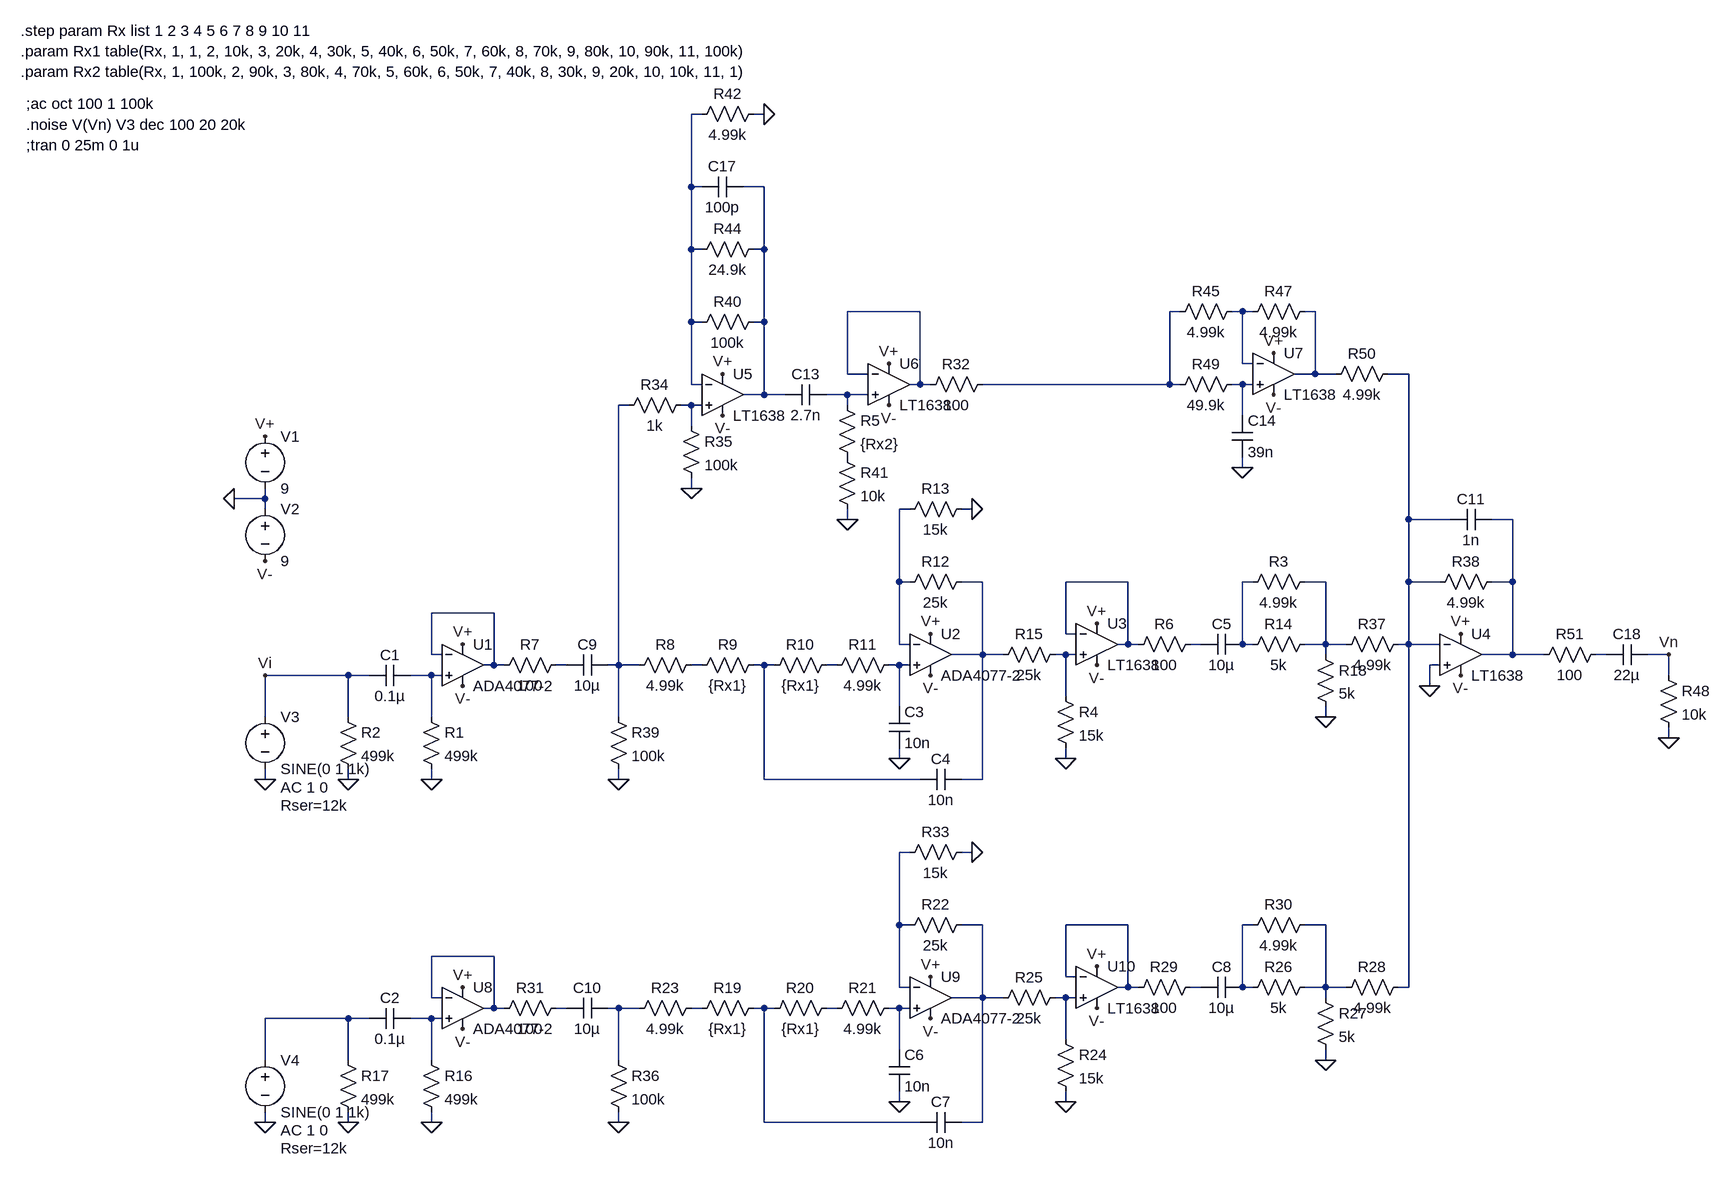
[diagram p0: schematic CB_FILTER.asc]
CB_FILTER.asc, the LTspice schematic file:
Version 4
SHEET 1 3604 4264
WIRE 592 -608 576 -608
WIRE 688 -608 672 -608
WIRE 576 -496 576 -608
WIRE 592 -496 576 -496
WIRE 688 -496 656 -496
WIRE 576 -400 576 -496
WIRE 592 -400 576 -400
WIRE 688 -400 688 -496
WIRE 688 -400 672 -400
WIRE 928 -304 816 -304
WIRE 1328 -304 1312 -304
WIRE 1424 -304 1408 -304
WIRE 1440 -304 1424 -304
WIRE 1536 -304 1520 -304
WIRE 576 -288 576 -400
WIRE 592 -288 576 -288
WIRE 688 -288 688 -400
WIRE 688 -288 672 -288
WIRE 1424 -224 1424 -304
WIRE 1440 -224 1424 -224
WIRE 816 -208 816 -304
WIRE 848 -208 816 -208
WIRE 1536 -208 1536 -304
WIRE 1536 -208 1504 -208
WIRE 1568 -208 1536 -208
WIRE 1680 -208 1648 -208
WIRE 576 -192 576 -288
WIRE 592 -192 576 -192
WIRE 928 -192 928 -304
WIRE 928 -192 912 -192
WIRE 944 -192 928 -192
WIRE 1312 -192 1312 -304
WIRE 1312 -192 1024 -192
WIRE 1328 -192 1312 -192
WIRE 1424 -192 1408 -192
WIRE 1440 -192 1424 -192
WIRE 688 -176 688 -288
WIRE 688 -176 656 -176
WIRE 720 -176 688 -176
WIRE 816 -176 784 -176
WIRE 848 -176 816 -176
WIRE 480 -160 464 -160
WIRE 576 -160 560 -160
WIRE 592 -160 576 -160
WIRE 816 -160 816 -176
WIRE 1424 -144 1424 -192
WIRE 576 -128 576 -160
WIRE 1424 -64 1424 -80
WIRE 576 -32 576 -48
WIRE -80 -16 -80 -32
WIRE -80 -16 -128 -16
WIRE -80 0 -80 -16
WIRE 912 0 896 0
WIRE 1008 0 992 0
WIRE 816 16 816 0
WIRE 1680 16 1680 -208
WIRE 1744 16 1680 16
WIRE 1840 16 1808 16
WIRE 896 112 896 0
WIRE 912 112 896 112
WIRE 1024 112 992 112
WIRE 1248 112 1152 112
WIRE 1440 112 1424 112
WIRE 1552 112 1520 112
WIRE 1680 112 1680 16
WIRE 1728 112 1680 112
WIRE 1840 112 1840 16
WIRE 1840 112 1808 112
WIRE 272 160 176 160
WIRE 1152 192 1152 112
WIRE 1168 192 1152 192
WIRE 896 208 896 112
WIRE 912 208 896 208
WIRE 1248 208 1248 112
WIRE 1248 208 1232 208
WIRE 1264 208 1248 208
WIRE 1360 208 1344 208
WIRE 1424 208 1424 112
WIRE 1440 208 1424 208
WIRE 1552 208 1552 112
WIRE 1552 208 1520 208
WIRE 1584 208 1552 208
WIRE 1680 208 1680 112
WIRE 1680 208 1664 208
WIRE 1728 208 1680 208
WIRE 176 224 176 160
WIRE 192 224 176 224
WIRE 1024 224 1024 112
WIRE 1024 224 976 224
WIRE 1056 224 1024 224
WIRE 1152 224 1136 224
WIRE 1168 224 1152 224
WIRE 1552 224 1552 208
WIRE 1840 224 1840 112
WIRE 1840 224 1792 224
WIRE 1888 224 1840 224
WIRE 1984 224 1968 224
WIRE 2080 224 2048 224
WIRE 272 240 272 160
WIRE 272 240 256 240
WIRE 288 240 272 240
WIRE 384 240 368 240
WIRE 464 240 464 -160
WIRE 464 240 448 240
WIRE 496 240 464 240
WIRE 592 240 576 240
WIRE 688 240 672 240
WIRE 704 240 688 240
WIRE 800 240 784 240
WIRE 896 240 880 240
WIRE 912 240 896 240
WIRE 1728 240 1712 240
WIRE 48 256 -80 256
WIRE 80 256 48 256
WIRE 176 256 144 256
WIRE 192 256 176 256
WIRE 2080 256 2080 224
WIRE 1712 272 1712 240
WIRE 1152 288 1152 224
WIRE 896 304 896 240
WIRE -80 320 -80 256
WIRE 48 320 48 256
WIRE 176 320 176 256
WIRE 464 320 464 240
WIRE 1552 320 1552 304
WIRE 2080 352 2080 336
WIRE 896 384 896 368
WIRE 1152 384 1152 368
WIRE -80 416 -80 400
WIRE 48 416 48 400
WIRE 176 416 176 400
WIRE 464 416 464 400
WIRE 688 416 688 240
WIRE 928 416 688 416
WIRE 1024 416 1024 224
WIRE 1024 416 992 416
WIRE 912 528 896 528
WIRE 1008 528 992 528
WIRE 896 640 896 528
WIRE 912 640 896 640
WIRE 1024 640 992 640
WIRE 1248 640 1152 640
WIRE 1440 640 1424 640
WIRE 1552 640 1520 640
WIRE 272 688 176 688
WIRE 1152 720 1152 640
WIRE 1168 720 1152 720
WIRE 896 736 896 640
WIRE 912 736 896 736
WIRE 1248 736 1248 640
WIRE 1248 736 1232 736
WIRE 1264 736 1248 736
WIRE 1360 736 1344 736
WIRE 1424 736 1424 640
WIRE 1440 736 1424 736
WIRE 1552 736 1552 640
WIRE 1552 736 1520 736
WIRE 1584 736 1552 736
WIRE 1680 736 1680 208
WIRE 1680 736 1664 736
WIRE 176 752 176 688
WIRE 192 752 176 752
WIRE 1024 752 1024 640
WIRE 1024 752 976 752
WIRE 1056 752 1024 752
WIRE 1152 752 1136 752
WIRE 1168 752 1152 752
WIRE 1552 752 1552 736
WIRE 272 768 272 688
WIRE 272 768 256 768
WIRE 288 768 272 768
WIRE 384 768 368 768
WIRE 464 768 448 768
WIRE 496 768 464 768
WIRE 592 768 576 768
WIRE 688 768 672 768
WIRE 704 768 688 768
WIRE 800 768 784 768
WIRE 896 768 880 768
WIRE 912 768 896 768
WIRE 48 784 -80 784
WIRE 80 784 48 784
WIRE 176 784 144 784
WIRE 192 784 176 784
WIRE 1152 816 1152 752
WIRE 896 832 896 768
WIRE -80 848 -80 784
WIRE 48 848 48 784
WIRE 176 848 176 784
WIRE 464 848 464 768
WIRE 1552 848 1552 832
WIRE 896 912 896 896
WIRE 1152 912 1152 896
WIRE -80 944 -80 928
WIRE 48 944 48 928
WIRE 176 944 176 928
WIRE 464 944 464 928
WIRE 688 944 688 768
WIRE 928 944 688 944
WIRE 1024 944 1024 752
WIRE 1024 944 992 944
FLAG -128 -16 0
FLAG -80 -112 V+
FLAG -80 80 V-
FLAG 48 416 0
FLAG -80 416 0
FLAG 1200 240 V-
FLAG 1200 176 V+
FLAG 944 256 V-
FLAG 944 192 V+
FLAG 1008 0 0
FLAG 896 384 0
FLAG 2080 224 Vn
FLAG 1152 384 0
FLAG 1552 320 0
FLAG 1760 256 V-
FLAG 1760 192 V+
FLAG 624 -144 V-
FLAG 624 -208 V+
FLAG 880 -160 V-
FLAG 880 -224 V+
FLAG 816 16 0
FLAG 1472 -176 V-
FLAG 1472 -240 V+
FLAG 1424 -64 0
FLAG 2080 352 0
FLAG 688 -608 0
FLAG 1712 272 0
FLAG -80 256 Vi
FLAG 176 416 0
FLAG 224 208 V+
FLAG 224 272 V-
FLAG 576 -32 0
FLAG 48 944 0
FLAG -80 944 0
FLAG 1200 768 V-
FLAG 1200 704 V+
FLAG 944 784 V-
FLAG 944 720 V+
FLAG 896 912 0
FLAG 1152 912 0
FLAG 1552 848 0
FLAG 176 944 0
FLAG 224 736 V+
FLAG 224 800 V-
FLAG 1008 528 0
FLAG 464 944 0
FLAG 464 416 0
SYMBOL voltage -80 -128 R0
SYMATTR InstName V1
SYMATTR Value 9
SYMBOL voltage -80 -16 R0
SYMATTR InstName V2
SYMATTR Value 9
SYMBOL res 160 304 R0
SYMATTR InstName R1
SYMATTR Value 499k
SYMBOL cap 144 240 R90
WINDOW 0 0 32 VBottom 2
WINDOW 3 32 32 VTop 2
SYMATTR InstName C1
SYMATTR Value 0.1µ
SYMBOL res 32 304 R0
SYMATTR InstName R2
SYMATTR Value 499k
SYMBOL voltage -80 304 R0
WINDOW 123 24 124 Left 2
WINDOW 39 24 152 Left 2
SYMATTR Value2 AC 1 0
SYMATTR SpiceLine Rser=12k
SYMATTR InstName V3
SYMATTR Value SINE(0 1 1k)
SYMBOL res 688 224 R90
WINDOW 0 0 56 VBottom 2
WINDOW 3 32 56 VTop 2
SYMATTR InstName R9
SYMATTR Value {Rx1}
SYMBOL res 800 224 R90
WINDOW 0 0 56 VBottom 2
WINDOW 3 32 56 VTop 2
SYMATTR InstName R10
SYMATTR Value {Rx1}
SYMBOL res 896 224 R90
WINDOW 0 0 56 VBottom 2
WINDOW 3 32 56 VTop 2
SYMATTR InstName R11
SYMATTR Value 4.99k
SYMBOL res 1008 96 R90
WINDOW 0 0 56 VBottom 2
WINDOW 3 32 56 VTop 2
SYMATTR InstName R12
SYMATTR Value 25k
SYMBOL res 1008 -16 R90
WINDOW 0 0 56 VBottom 2
WINDOW 3 32 56 VTop 2
SYMATTR InstName R13
SYMATTR Value 15k
SYMBOL cap 880 304 R0
SYMATTR InstName C3
SYMATTR Value 10n
SYMBOL cap 992 400 R90
WINDOW 0 0 32 VBottom 2
WINDOW 3 32 32 VTop 2
SYMATTR InstName C4
SYMATTR Value 10n
SYMBOL res 592 224 R90
WINDOW 0 0 56 VBottom 2
WINDOW 3 32 56 VTop 2
SYMATTR InstName R8
SYMATTR Value 4.99k
SYMBOL res 1136 272 R0
SYMATTR InstName R4
SYMATTR Value 15k
SYMBOL cap 1424 192 R90
WINDOW 0 0 32 VBottom 2
WINDOW 3 32 32 VTop 2
SYMATTR InstName C5
SYMATTR Value 10µ
SYMBOL res 1152 208 R90
WINDOW 0 0 56 VBottom 2
WINDOW 3 32 56 VTop 2
SYMATTR InstName R15
SYMATTR Value 25k
SYMBOL res 1536 192 R90
WINDOW 0 0 56 VBottom 2
WINDOW 3 32 56 VTop 2
SYMATTR InstName R14
SYMATTR Value 5k
SYMBOL res 1536 208 R0
SYMATTR InstName R18
SYMATTR Value 5k
SYMBOL res 1680 192 R90
WINDOW 0 0 56 VBottom 2
WINDOW 3 32 56 VTop 2
SYMATTR InstName R37
SYMATTR Value 4.99k
SYMBOL res 1824 96 R90
WINDOW 0 0 56 VBottom 2
WINDOW 3 32 56 VTop 2
SYMATTR InstName R38
SYMATTR Value 4.99k
SYMBOL cap 1808 0 R90
WINDOW 0 0 32 VBottom 2
WINDOW 3 32 32 VTop 2
SYMATTR InstName C11
SYMATTR Value 1n
SYMBOL res 688 -624 R90
WINDOW 0 0 56 VBottom 2
WINDOW 3 32 56 VTop 2
SYMATTR InstName R42
SYMATTR Value 4.99k
SYMBOL res 688 -416 R90
WINDOW 0 0 56 VBottom 2
WINDOW 3 32 56 VTop 2
SYMATTR InstName R44
SYMATTR Value 24.9k
SYMBOL cap 784 -192 R90
WINDOW 0 0 32 VBottom 2
WINDOW 3 32 32 VTop 2
SYMATTR InstName C13
SYMATTR Value 2.7n
SYMBOL res 800 -176 R0
SYMATTR InstName R5
SYMATTR Value {Rx2}
SYMBOL res 800 -96 R0
SYMATTR InstName R41
SYMATTR Value 10k
SYMBOL res 1424 -320 R90
WINDOW 0 0 56 VBottom 2
WINDOW 3 32 56 VTop 2
SYMATTR InstName R45
SYMATTR Value 4.99k
SYMBOL cap 1408 -144 R0
SYMATTR InstName C14
SYMATTR Value 39n
SYMBOL res 1536 -320 R90
WINDOW 0 0 56 VBottom 2
WINDOW 3 32 56 VTop 2
SYMATTR InstName R47
SYMATTR Value 4.99k
SYMBOL res 1312 -176 R270
WINDOW 0 32 56 VTop 2
WINDOW 3 0 56 VBottom 2
SYMATTR InstName R49
SYMATTR Value 49.9k
SYMBOL res 1664 -224 R90
WINDOW 0 0 56 VBottom 2
WINDOW 3 32 56 VTop 2
SYMATTR InstName R50
SYMATTR Value 4.99k
SYMBOL cap 656 -512 R90
WINDOW 0 0 32 VBottom 2
WINDOW 3 32 32 VTop 2
SYMATTR InstName C17
SYMATTR Value 100p
SYMBOL res 2064 240 R0
SYMATTR InstName R48
SYMATTR Value 10k
SYMBOL res 1984 208 R90
WINDOW 0 0 56 VBottom 2
WINDOW 3 32 56 VTop 2
SYMATTR InstName R51
SYMATTR Value 100
SYMBOL cap 2048 208 R90
WINDOW 0 0 32 VBottom 2
WINDOW 3 32 32 VTop 2
SYMATTR InstName C18
SYMATTR Value 22µ
SYMBOL res 1040 -208 R90
WINDOW 0 0 56 VBottom 2
WINDOW 3 32 56 VTop 2
SYMATTR InstName R32
SYMATTR Value 100
SYMBOL res 1360 192 R90
WINDOW 0 0 56 VBottom 2
WINDOW 3 32 56 VTop 2
SYMATTR InstName R6
SYMATTR Value 100
SYMBOL res 576 -176 R90
WINDOW 0 0 56 VBottom 2
WINDOW 3 32 56 VTop 2
SYMATTR InstName R34
SYMATTR Value 1k
SYMBOL res 1536 96 R90
WINDOW 0 0 56 VBottom 2
WINDOW 3 32 56 VTop 2
SYMATTR InstName R3
SYMATTR Value 4.99k
SYMBOL res 384 224 R90
WINDOW 0 0 56 VBottom 2
WINDOW 3 32 56 VTop 2
SYMATTR InstName R7
SYMATTR Value 100
SYMBOL cap 448 224 R90
WINDOW 0 0 32 VBottom 2
WINDOW 3 32 32 VTop 2
SYMATTR InstName C9
SYMATTR Value 10µ
SYMBOL res 560 -144 R0
SYMATTR InstName R35
SYMATTR Value 100k
SYMBOL Opamps\\LT1638 1200 144 R0
SYMATTR InstName U3
SYMBOL Opamps\\LT1638 1760 160 R0
SYMATTR InstName U4
SYMBOL Opamps\\LT1638 624 -240 R0
SYMATTR InstName U5
SYMBOL Opamps\\LT1638 880 -256 R0
SYMATTR InstName U6
SYMBOL Opamps\\LT1638 1472 -272 R0
SYMATTR InstName U7
SYMBOL res 160 832 R0
SYMATTR InstName R16
SYMATTR Value 499k
SYMBOL cap 144 768 R90
WINDOW 0 0 32 VBottom 2
WINDOW 3 32 32 VTop 2
SYMATTR InstName C2
SYMATTR Value 0.1µ
SYMBOL res 32 832 R0
SYMATTR InstName R17
SYMATTR Value 499k
SYMBOL voltage -80 832 R0
WINDOW 123 24 124 Left 2
WINDOW 39 24 152 Left 2
SYMATTR Value2 AC 1 0
SYMATTR SpiceLine Rser=12k
SYMATTR InstName V4
SYMATTR Value SINE(0 1 1k)
SYMBOL res 688 752 R90
WINDOW 0 0 56 VBottom 2
WINDOW 3 32 56 VTop 2
SYMATTR InstName R19
SYMATTR Value {Rx1}
SYMBOL res 800 752 R90
WINDOW 0 0 56 VBottom 2
WINDOW 3 32 56 VTop 2
SYMATTR InstName R20
SYMATTR Value {Rx1}
SYMBOL res 896 752 R90
WINDOW 0 0 56 VBottom 2
WINDOW 3 32 56 VTop 2
SYMATTR InstName R21
SYMATTR Value 4.99k
SYMBOL res 1008 624 R90
WINDOW 0 0 56 VBottom 2
WINDOW 3 32 56 VTop 2
SYMATTR InstName R22
SYMATTR Value 25k
SYMBOL cap 880 832 R0
SYMATTR InstName C6
SYMATTR Value 10n
SYMBOL cap 992 928 R90
WINDOW 0 0 32 VBottom 2
WINDOW 3 32 32 VTop 2
SYMATTR InstName C7
SYMATTR Value 10n
SYMBOL res 592 752 R90
WINDOW 0 0 56 VBottom 2
WINDOW 3 32 56 VTop 2
SYMATTR InstName R23
SYMATTR Value 4.99k
SYMBOL res 1136 800 R0
SYMATTR InstName R24
SYMATTR Value 15k
SYMBOL cap 1424 720 R90
WINDOW 0 0 32 VBottom 2
WINDOW 3 32 32 VTop 2
SYMATTR InstName C8
SYMATTR Value 10µ
SYMBOL res 1152 736 R90
WINDOW 0 0 56 VBottom 2
WINDOW 3 32 56 VTop 2
SYMATTR InstName R25
SYMATTR Value 25k
SYMBOL res 1536 720 R90
WINDOW 0 0 56 VBottom 2
WINDOW 3 32 56 VTop 2
SYMATTR InstName R26
SYMATTR Value 5k
SYMBOL res 1536 736 R0
SYMATTR InstName R27
SYMATTR Value 5k
SYMBOL res 1680 720 R90
WINDOW 0 0 56 VBottom 2
WINDOW 3 32 56 VTop 2
SYMATTR InstName R28
SYMATTR Value 4.99k
SYMBOL res 1360 720 R90
WINDOW 0 0 56 VBottom 2
WINDOW 3 32 56 VTop 2
SYMATTR InstName R29
SYMATTR Value 100
SYMBOL res 1536 624 R90
WINDOW 0 0 56 VBottom 2
WINDOW 3 32 56 VTop 2
SYMATTR InstName R30
SYMATTR Value 4.99k
SYMBOL res 384 752 R90
WINDOW 0 0 56 VBottom 2
WINDOW 3 32 56 VTop 2
SYMATTR InstName R31
SYMATTR Value 100
SYMBOL cap 448 752 R90
WINDOW 0 0 32 VBottom 2
WINDOW 3 32 32 VTop 2
SYMATTR InstName C10
SYMATTR Value 10µ
SYMBOL Opamps\\LT1638 1200 672 R0
SYMATTR InstName U10
SYMBOL res 1008 512 R90
WINDOW 0 0 56 VBottom 2
WINDOW 3 32 56 VTop 2
SYMATTR InstName R33
SYMATTR Value 15k
SYMBOL Opamps\\ADA4077-2 224 176 R0
SYMATTR InstName U1
SYMBOL Opamps\\ADA4077-2 944 160 R0
SYMATTR InstName U2
SYMBOL Opamps\\ADA4077-2 224 704 R0
SYMATTR InstName U8
SYMBOL Opamps\\ADA4077-2 944 688 R0
SYMATTR InstName U9
SYMBOL res 448 832 R0
SYMATTR InstName R36
SYMATTR Value 100k
SYMBOL res 448 304 R0
SYMATTR InstName R39
SYMATTR Value 100k
SYMBOL res 688 -304 R90
WINDOW 0 0 56 VBottom 2
WINDOW 3 32 56 VTop 2
SYMATTR InstName R40
SYMATTR Value 100k
TEXT -448 -624 Left 2 !;ac oct 100 1 100k
TEXT -448 -592 Left 2 !.noise V(Vn) V3 dec 100 20 20k
TEXT -456 -736 Left 2 !.step param Rx list 1 2 3 4 5 6 7 8 9 10 11\n.param Rx1 table(Rx, 1, 1, 2, 10k, 3, 20k, 4, 30k, 5, 40k, 6, 50k, 7, 60k, 8, 70k, 9, 80k, 10, 90k, 11, 100k)\n.param Rx2 table(Rx, 1, 100k, 2, 90k, 3, 80k, 4, 70k, 5, 60k, 6, 50k, 7, 40k, 8, 30k, 9, 20k, 10, 10k, 11, 1)
TEXT -448 -560 Left 2 !;tran 0 25m 0 1u

The netlist it stands for:
* CB_FILTER.asc
V1 V+ 0 9
V2 0 V- 9
R1 N027 0 499k
C1 N027 Vi 0.1µ
R2 Vi 0 499k
V3 Vi 0 SINE(0 1 1k) AC 1 0 Rser=12k
R9 N024 N023 {Rx1}
R10 N025 N024 {Rx1}
R11 N026 N025 4.99k
R12 N014 N012 25k
R13 0 N012 15k
C3 N026 0 10n
C4 N014 N024 10n
R8 N023 N010 4.99k
R4 N020 0 15k
C5 N016 N019 10µ
R15 N020 N014 25k
R14 N017 N016 5k
R18 N017 0 5k
R37 N007 N017 4.99k
R38 N013 N007 4.99k
C11 N013 N007 1n
R42 0 N001 4.99k
R44 N002 N001 24.9k
C13 N009 N002 2.7n
R5 N009 P001 {Rx2}
R41 P001 0 10k
R45 N005 N004 4.99k
C14 N008 0 39n
R47 N006 N005 4.99k
R49 N004 N008 49.9k
R50 N007 N006 4.99k
C17 N002 N001 100p
R48 Vn 0 10k
R51 N021 N013 100
C18 Vn N021 22µ
R32 N004 N003 100
R6 N019 N015 100
R34 N011 N010 1k
R3 N017 N016 4.99k
R7 N022 N018 100
C9 N010 N022 10µ
R35 N011 0 100k
XU3 N020 N015 V+ V- N015 LT1638  ; pins In+ In- V+ V- OUT
XU4 0 N007 V+ V- N013 LT1638  ; pins In+ In- V+ V- OUT
XU5 N011 N001 V+ V- N002 LT1638  ; pins In+ In- V+ V- OUT
XU6 N009 N003 V+ V- N003 LT1638  ; pins In+ In- V+ V- OUT
XU7 N008 N005 V+ V- N006 LT1638  ; pins In+ In- V+ V- OUT
R16 N043 0 499k
C2 N043 N042 0.1µ
R17 N042 0 499k
V4 N042 0 SINE(0 1 1k) AC 1 0 Rser=12k
R19 N039 N038 {Rx1}
R20 N040 N039 {Rx1}
R21 N041 N040 4.99k
R22 N029 N028 25k
C6 N041 0 10n
C7 N029 N039 10n
R23 N038 N037 4.99k
R24 N035 0 15k
C8 N031 N034 10µ
R25 N035 N029 25k
R26 N032 N031 5k
R27 N032 0 5k
R28 N007 N032 4.99k
R29 N034 N030 100
R30 N032 N031 4.99k
R31 N036 N033 100
C10 N037 N036 10µ
XU10 N035 N030 V+ V- N030 LT1638  ; pins In+ In- V+ V- OUT
R33 0 N028 15k
XU1 N027 N018 V+ V- N018 ADA4077-2  ; pins In+ In- V+ V- OUT
XU2 N026 N012 V+ V- N014 ADA4077-2  ; pins In+ In- V+ V- OUT
XU8 N043 N033 V+ V- N033 ADA4077-2  ; pins In+ In- V+ V- OUT
XU9 N041 N028 V+ V- N029 ADA4077-2  ; pins In+ In- V+ V- OUT
R36 N037 0 100k
R39 N010 0 100k
R40 N002 N001 100k
;ac oct 100 1 100k
.noise V(Vn) V3 dec 100 20 20k
.step param Rx list 1 2 3 4 5 6 7 8 9 10 11
.param Rx1 table(Rx, 1, 1, 2, 10k, 3, 20k, 4, 30k, 5, 40k, 6, 50k, 7, 60k, 8, 70k, 9, 80k, 10, 90k, 11, 100k)
.param Rx2 table(Rx, 1, 100k, 2, 90k, 3, 80k, 4, 70k, 5, 60k, 6, 50k, 7, 40k, 8, 30k, 9, 20k, 10, 10k, 11, 1)
;tran 0 25m 0 1u
.backanno
.end